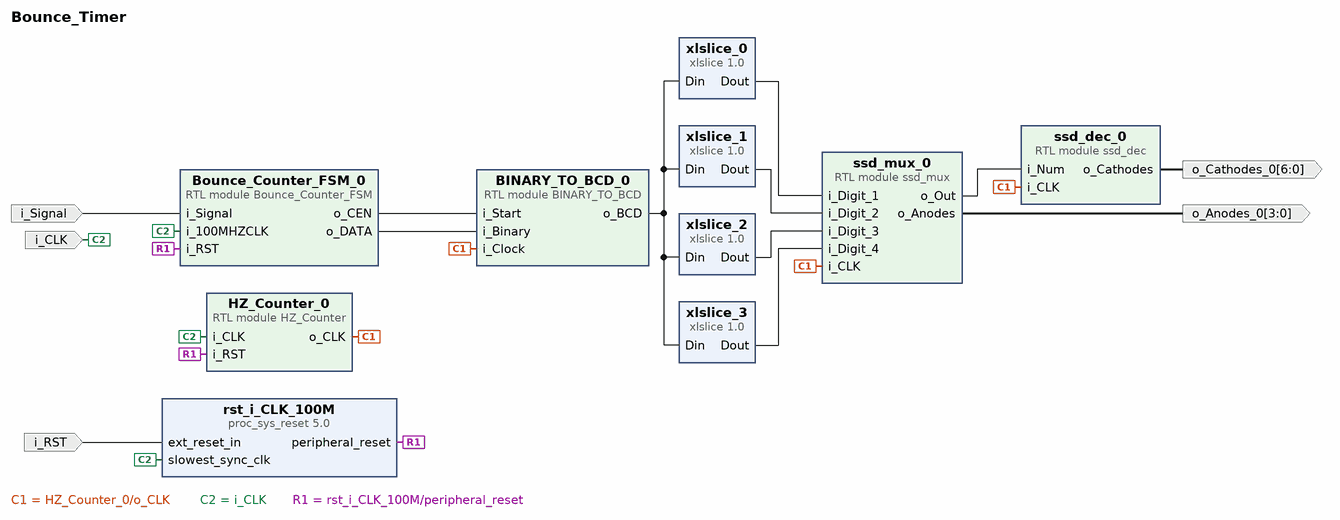
[diagram p0: block diagram of the top level]
# Vivado block design Bounce_Timer, xc7z007sclg400-1, Vivado 2019.1
create_bd_design Bounce_Timer

create_bd_port -dir O -from 6 -to 0 o_Cathodes_0
create_bd_port -dir O -from 3 -to 0 o_Anodes_0
create_bd_port -dir I -type clk i_CLK
set_property -dict {CONFIG.FREQ_HZ 100000000} [get_bd_ports i_CLK]
create_bd_port -dir I i_Signal
create_bd_port -dir I -type rst i_RST
set_property -dict {CONFIG.POLARITY ACTIVE_HIGH} [get_bd_ports i_RST]

create_bd_cell -type module -reference ssd_dec ssd_dec_0
create_bd_cell -type module -reference ssd_mux ssd_mux_0
create_bd_cell -type module -reference BINARY_TO_BCD BINARY_TO_BCD_0
create_bd_cell -type ip -vlnv xilinx.com:ip:xlslice:1.0 xlslice_0
set_property -dict {CONFIG.DIN_FROM 15 CONFIG.DIN_TO 12 CONFIG.DIN_WIDTH 16 CONFIG.DOUT_WIDTH 4} [get_bd_cells xlslice_0]
create_bd_cell -type ip -vlnv xilinx.com:ip:xlslice:1.0 xlslice_1
set_property -dict {CONFIG.DIN_FROM 11 CONFIG.DIN_TO 8 CONFIG.DIN_WIDTH 16 CONFIG.DOUT_WIDTH 4} [get_bd_cells xlslice_1]
create_bd_cell -type ip -vlnv xilinx.com:ip:xlslice:1.0 xlslice_2
set_property -dict {CONFIG.DIN_FROM 7 CONFIG.DIN_TO 4 CONFIG.DIN_WIDTH 16 CONFIG.DOUT_WIDTH 4} [get_bd_cells xlslice_2]
create_bd_cell -type ip -vlnv xilinx.com:ip:xlslice:1.0 xlslice_3
set_property -dict {CONFIG.DIN_FROM 3 CONFIG.DIN_TO 0 CONFIG.DIN_WIDTH 16 CONFIG.DOUT_WIDTH 4} [get_bd_cells xlslice_3]
create_bd_cell -type module -reference HZ_Counter HZ_Counter_0
set_property -dict {CONFIG.c_NUM 50000} [get_bd_cells HZ_Counter_0]
create_bd_cell -type ip -vlnv xilinx.com:ip:proc_sys_reset:5.0 rst_i_CLK_100M
create_bd_cell -type module -reference Bounce_Counter_FSM Bounce_Counter_FSM_0

# ---- connections ----

connect_bd_net [get_bd_pins ssd_mux_0/o_Out] [get_bd_pins ssd_dec_0/i_Num]
connect_bd_net [get_bd_pins ssd_dec_0/o_Cathodes] [get_bd_ports o_Cathodes_0]
connect_bd_net [get_bd_pins ssd_mux_0/o_Anodes] [get_bd_ports o_Anodes_0]
connect_bd_net -net i_Signal_0_1 [get_bd_ports i_Signal] [get_bd_pins Bounce_Counter_FSM_0/i_Signal]
connect_bd_net [get_bd_pins Bounce_Counter_FSM_0/o_CEN] [get_bd_pins BINARY_TO_BCD_0/i_Start]
connect_bd_net [get_bd_pins Bounce_Counter_FSM_0/o_DATA] [get_bd_pins BINARY_TO_BCD_0/i_Binary]
connect_bd_net [get_bd_pins xlslice_0/Dout] [get_bd_pins ssd_mux_0/i_Digit_1]
connect_bd_net [get_bd_pins xlslice_1/Dout] [get_bd_pins ssd_mux_0/i_Digit_2]
connect_bd_net [get_bd_pins xlslice_3/Dout] [get_bd_pins ssd_mux_0/i_Digit_4]
connect_bd_net [get_bd_pins xlslice_2/Dout] [get_bd_pins ssd_mux_0/i_Digit_3]
connect_bd_net [get_bd_pins BINARY_TO_BCD_0/o_BCD] \
  [get_bd_pins xlslice_0/Din] [get_bd_pins xlslice_1/Din] [get_bd_pins xlslice_2/Din] [get_bd_pins xlslice_3/Din]
connect_bd_net -net HZ_Counter_0_o_Out [get_bd_pins HZ_Counter_0/o_CLK] \
  [get_bd_pins ssd_mux_0/i_CLK] [get_bd_pins BINARY_TO_BCD_0/i_Clock] [get_bd_pins ssd_dec_0/i_CLK]
connect_bd_net -net clk_wiz_0_clk_out1 [get_bd_ports i_CLK] \
  [get_bd_pins HZ_Counter_0/i_CLK] [get_bd_pins rst_i_CLK_100M/slowest_sync_clk] \
  [get_bd_pins Bounce_Counter_FSM_0/i_100MHZCLK]
connect_bd_net [get_bd_pins rst_i_CLK_100M/peripheral_reset] [get_bd_pins HZ_Counter_0/i_RST] [get_bd_pins Bounce_Counter_FSM_0/i_RST]
connect_bd_net [get_bd_ports i_RST] [get_bd_pins rst_i_CLK_100M/ext_reset_in]

set_property USER_COMMENTS.comment_0 {This needs to be piped to a BUFGCE
} [current_bd_design]

validate_bd_design
save_bd_design
